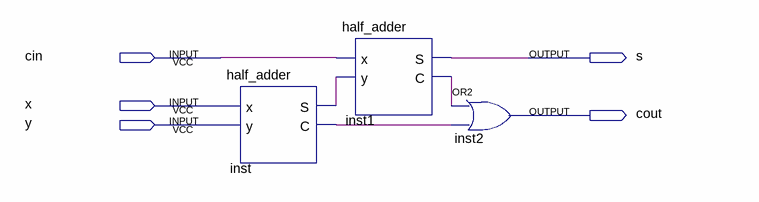
[diagram p0: schematic sheet]
// Quartus schematic full_adder.bdf as structural Verilog: 3 symbols, 5 pins
module full_adder (
  input  cin,
  input  x,
  input  y,
  output s,
  output cout
);

  wire inst1_c, inst_c, inst_s;

  half_adder inst (.x(x), .y(y), .S(inst_s), .C(inst_c));
  half_adder inst1 (.x(cin), .y(inst_s), .S(s), .C(inst1_c));
  or inst2 (cout, inst1_c, inst_c);
endmodule
